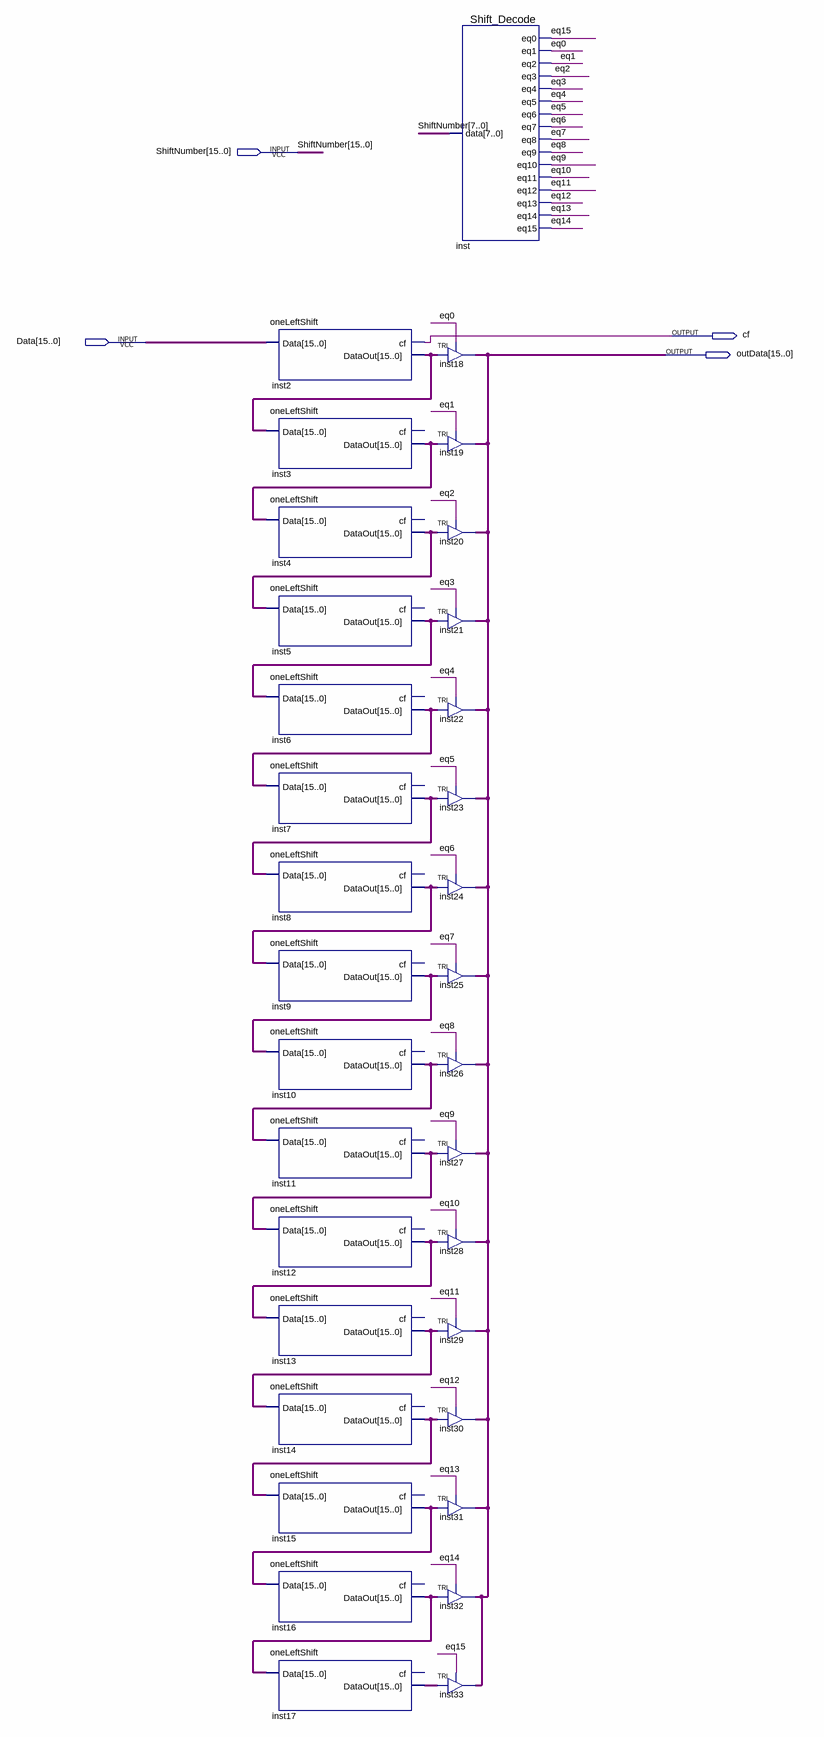
[diagram p0: schematic sheet]
// Quartus schematic ShiftLeft.bdf as structural Verilog: 33 symbols, 4 pins
module ShiftLeft (
  input  [15:0] ShiftNumber,
  input  [15:0] Data,
  output cf,
  output [15:0] outData
);

  wire eq0, eq1, eq2, eq3, eq4, eq5, eq6, eq7, eq8, eq9, eq10, eq11, eq12, eq13, eq14, eq15;
  wire [15:0] inst2_dataout, inst3_dataout, inst4_dataout, inst5_dataout, inst6_dataout, inst7_dataout,
       inst8_dataout, inst9_dataout, inst10_dataout, inst11_dataout, inst12_dataout, inst13_dataout,
       inst14_dataout, inst15_dataout, inst16_dataout, inst17_dataout;

  oneLeftShift inst2 (.Data(Data), .cf(cf), .DataOut(inst2_dataout));
  oneLeftShift inst3 (.Data(inst2_dataout), .DataOut(inst3_dataout));  // open: cf
  oneLeftShift inst4 (.Data(inst3_dataout), .DataOut(inst4_dataout));  // open: cf
  oneLeftShift inst5 (.Data(inst4_dataout), .DataOut(inst5_dataout));  // open: cf
  oneLeftShift inst6 (.Data(inst5_dataout), .DataOut(inst6_dataout));  // open: cf
  oneLeftShift inst7 (.Data(inst6_dataout), .DataOut(inst7_dataout));  // open: cf
  oneLeftShift inst8 (.Data(inst7_dataout), .DataOut(inst8_dataout));  // open: cf
  oneLeftShift inst9 (.Data(inst8_dataout), .DataOut(inst9_dataout));  // open: cf
  oneLeftShift inst10 (.Data(inst9_dataout), .DataOut(inst10_dataout));  // open: cf
  oneLeftShift inst11 (.Data(inst10_dataout), .DataOut(inst11_dataout));  // open: cf
  oneLeftShift inst12 (.Data(inst11_dataout), .DataOut(inst12_dataout));  // open: cf
  oneLeftShift inst13 (.Data(inst12_dataout), .DataOut(inst13_dataout));  // open: cf
  oneLeftShift inst14 (.Data(inst13_dataout), .DataOut(inst14_dataout));  // open: cf
  oneLeftShift inst15 (.Data(inst14_dataout), .DataOut(inst15_dataout));  // open: cf
  oneLeftShift inst16 (.Data(inst15_dataout), .DataOut(inst16_dataout));  // open: cf
  oneLeftShift inst17 (.Data(inst16_dataout), .DataOut(inst17_dataout));  // open: cf
  TRI inst18[15:0] (.IN(inst2_dataout), .OE(eq0), .OUT(outData));
  TRI inst19[15:0] (.IN(inst3_dataout), .OE(eq1), .OUT(outData));
  TRI inst20[15:0] (.IN(inst4_dataout), .OE(eq2), .OUT(outData));
  TRI inst21[15:0] (.IN(inst5_dataout), .OE(eq3), .OUT(outData));
  TRI inst22[15:0] (.IN(inst6_dataout), .OE(eq4), .OUT(outData));
  TRI inst23[15:0] (.IN(inst7_dataout), .OE(eq5), .OUT(outData));
  TRI inst24[15:0] (.IN(inst8_dataout), .OE(eq6), .OUT(outData));
  TRI inst25[15:0] (.IN(inst9_dataout), .OE(eq7), .OUT(outData));
  TRI inst26[15:0] (.IN(inst10_dataout), .OE(eq8), .OUT(outData));
  TRI inst27[15:0] (.IN(inst11_dataout), .OE(eq9), .OUT(outData));
  TRI inst28[15:0] (.IN(inst12_dataout), .OE(eq10), .OUT(outData));
  TRI inst29[15:0] (.IN(inst13_dataout), .OE(eq11), .OUT(outData));
  TRI inst30[15:0] (.IN(inst14_dataout), .OE(eq12), .OUT(outData));
  TRI inst31[15:0] (.IN(inst15_dataout), .OE(eq13), .OUT(outData));
  TRI inst32[15:0] (.IN(inst16_dataout), .OE(eq14), .OUT(outData));
  TRI inst33[15:0] (.IN(inst17_dataout), .OE(eq15), .OUT(outData));
  Shift_Decode inst (
    .data(ShiftNumber[7:0]), .eq0(eq15), .eq1(eq0), .eq2(eq1), .eq3(eq2), .eq4(eq3), .eq5(eq4), .eq6(eq5),
    .eq7(eq6), .eq8(eq7), .eq9(eq8), .eq10(eq9), .eq11(eq10), .eq12(eq11), .eq13(eq12), .eq14(eq13),
    .eq15(eq14));
endmodule
